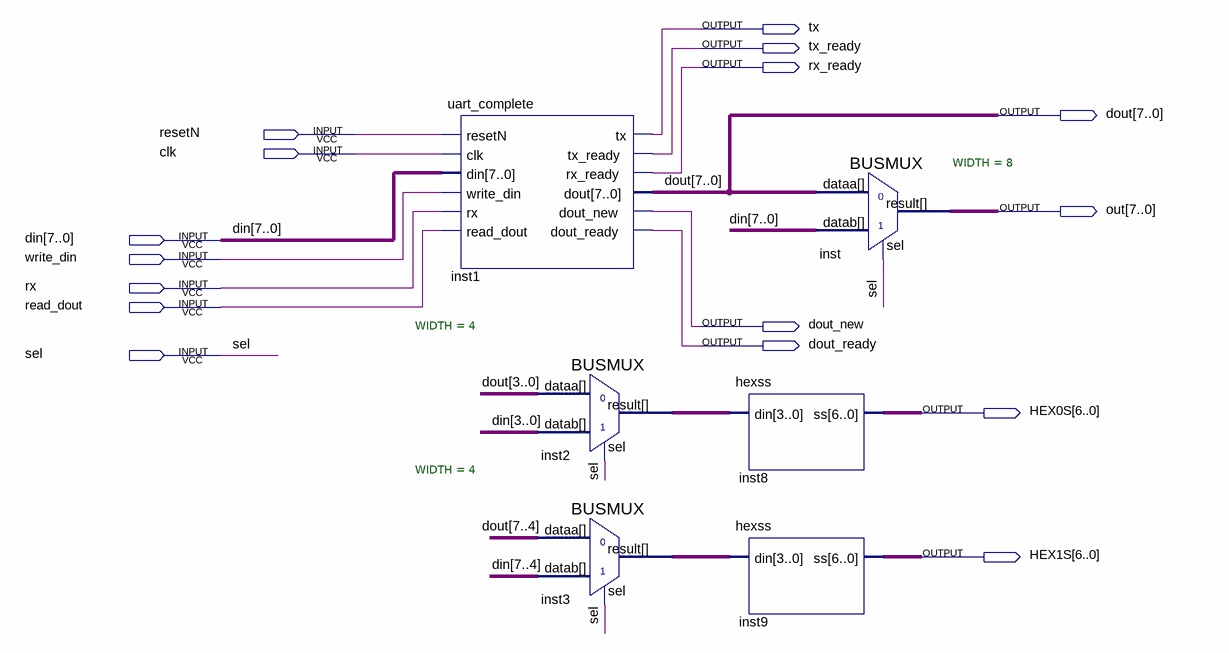
[diagram p0: schematic sheet]
// Quartus schematic uart_pack.bdf as structural Verilog: 6 symbols, 16 pins
module uart_pack (
  input  resetN,
  input  clk,
  input  [7:0] din,
  input  write_din,
  input  rx,
  input  read_dout,
  input  sel,
  output tx,
  output tx_ready,
  output rx_ready,
  output [7:0] dout,
  output [7:0] out,
  output dout_new,
  output dout_ready,
  output [6:0] HEX0S,
  output [6:0] HEX1S
);

  wire [3:0] inst2_result, inst3_result;

  uart_complete inst1 (
    .resetN(resetN), .clk(clk), .din(din), .write_din(write_din), .rx(rx), .read_dout(read_dout), .tx(tx),
    .tx_ready(tx_ready), .rx_ready(rx_ready), .dout(dout), .dout_new(dout_new), .dout_ready(dout_ready));
  BUSMUX #(.WIDTH(4)) inst2 (.datab(din[3:0]), .sel(sel), .dataa(dout[3:0]), .result(inst2_result));
  BUSMUX #(.WIDTH(4)) inst3 (.datab(din[7:4]), .sel(sel), .dataa(dout[7:4]), .result(inst3_result));
  hexss inst8 (.din(inst2_result), .ss(HEX0S));
  hexss inst9 (.din(inst3_result), .ss(HEX1S));
  BUSMUX #(.WIDTH(8)) inst (.datab(din), .sel(sel), .dataa(dout), .result(out));
endmodule
